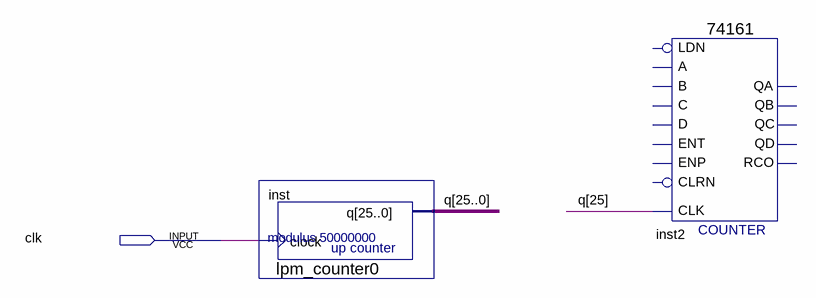
[diagram p0: schematic sheet]
// Quartus schematic test31.bdf as structural Verilog: 2 symbols, 1 pins
module test31 (
  input  clk
);

  wire [25:0] q;

  lpm_counter0 inst (.clock(clk), .q(q));
  \74161  inst2 (.CLK(q[25]));  // open: CLRN, ENP, LDN, A, D, ENT, B, C, QD, QC, QB, QA, RCO
endmodule
